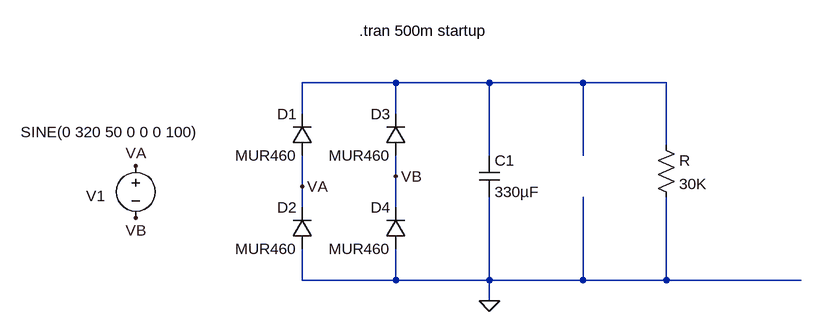
[diagram p0: schematic Draft1.asc]
Draft1.asc, the LTspice schematic file:
Version 4
SHEET 1 880 680
WIRE -416 -144 -560 -144
WIRE -272 -144 -416 -144
WIRE -128 -144 -272 -144
WIRE 0 -144 -128 -144
WIRE -560 -96 -560 -144
WIRE -416 -96 -416 -144
WIRE 0 -48 0 -144
WIRE -272 -32 -272 -144
WIRE -128 -32 -128 -144
WIRE -416 0 -416 -32
WIRE -560 16 -560 -32
WIRE -560 48 -560 16
WIRE -416 48 -416 0
WIRE -560 160 -560 112
WIRE -416 160 -416 112
WIRE -416 160 -560 160
WIRE -272 160 -272 32
WIRE -272 160 -416 160
WIRE -128 160 -128 32
WIRE -128 160 -272 160
WIRE 0 160 0 32
WIRE 0 160 -128 160
WIRE 208 160 0 160
WIRE -272 192 -272 160
FLAG -816 -16 VA
FLAG -816 64 VB
FLAG -560 16 VA
FLAG -416 0 VB
FLAG -272 192 0
SYMBOL voltage -816 -32 R0
WINDOW 0 -76 62 Left 2
WINDOW 3 -177 -36 Left 2
WINDOW 123 0 0 Left 0
WINDOW 39 0 0 Left 0
SYMATTR InstName V1
SYMATTR Value SINE(0 320 50 0 0 0 100)
SYMBOL diode -544 -32 R180
WINDOW 0 24 64 Left 2
WINDOW 3 24 0 Left 2
SYMATTR InstName D1
SYMATTR Value MUR460
SYMBOL diode -544 112 R180
WINDOW 0 24 64 Left 2
WINDOW 3 24 0 Left 2
SYMATTR InstName D2
SYMATTR Value MUR460
SYMBOL diode -400 -32 R180
WINDOW 0 24 64 Left 2
WINDOW 3 24 0 Left 2
SYMATTR InstName D3
SYMATTR Value MUR460
SYMBOL diode -400 112 R180
WINDOW 0 24 64 Left 2
WINDOW 3 24 0 Left 2
SYMATTR InstName D4
SYMATTR Value MUR460
SYMBOL res -16 -64 R0
SYMATTR InstName R
SYMATTR Value 30K
SYMBOL cap -288 -32 R0
SYMATTR InstName C1
SYMATTR Value 330µF
TEXT -472 -224 Left 2 !.tran 500m startup

The netlist it stands for:
* Draft1.asc
V1 VA VB SINE(0 320 50 0 0 0 100)
D1 VA N001 MUR460
D2 0 VA MUR460
D3 VB N001 MUR460
D4 0 VB MUR460
R N001 0 30K
C1 N001 0 330µF
.model D D
.lib standard.dio
.tran 500m startup
.backanno
.end